# Altium schematic sheet Sheet1.SchDoc
size A2
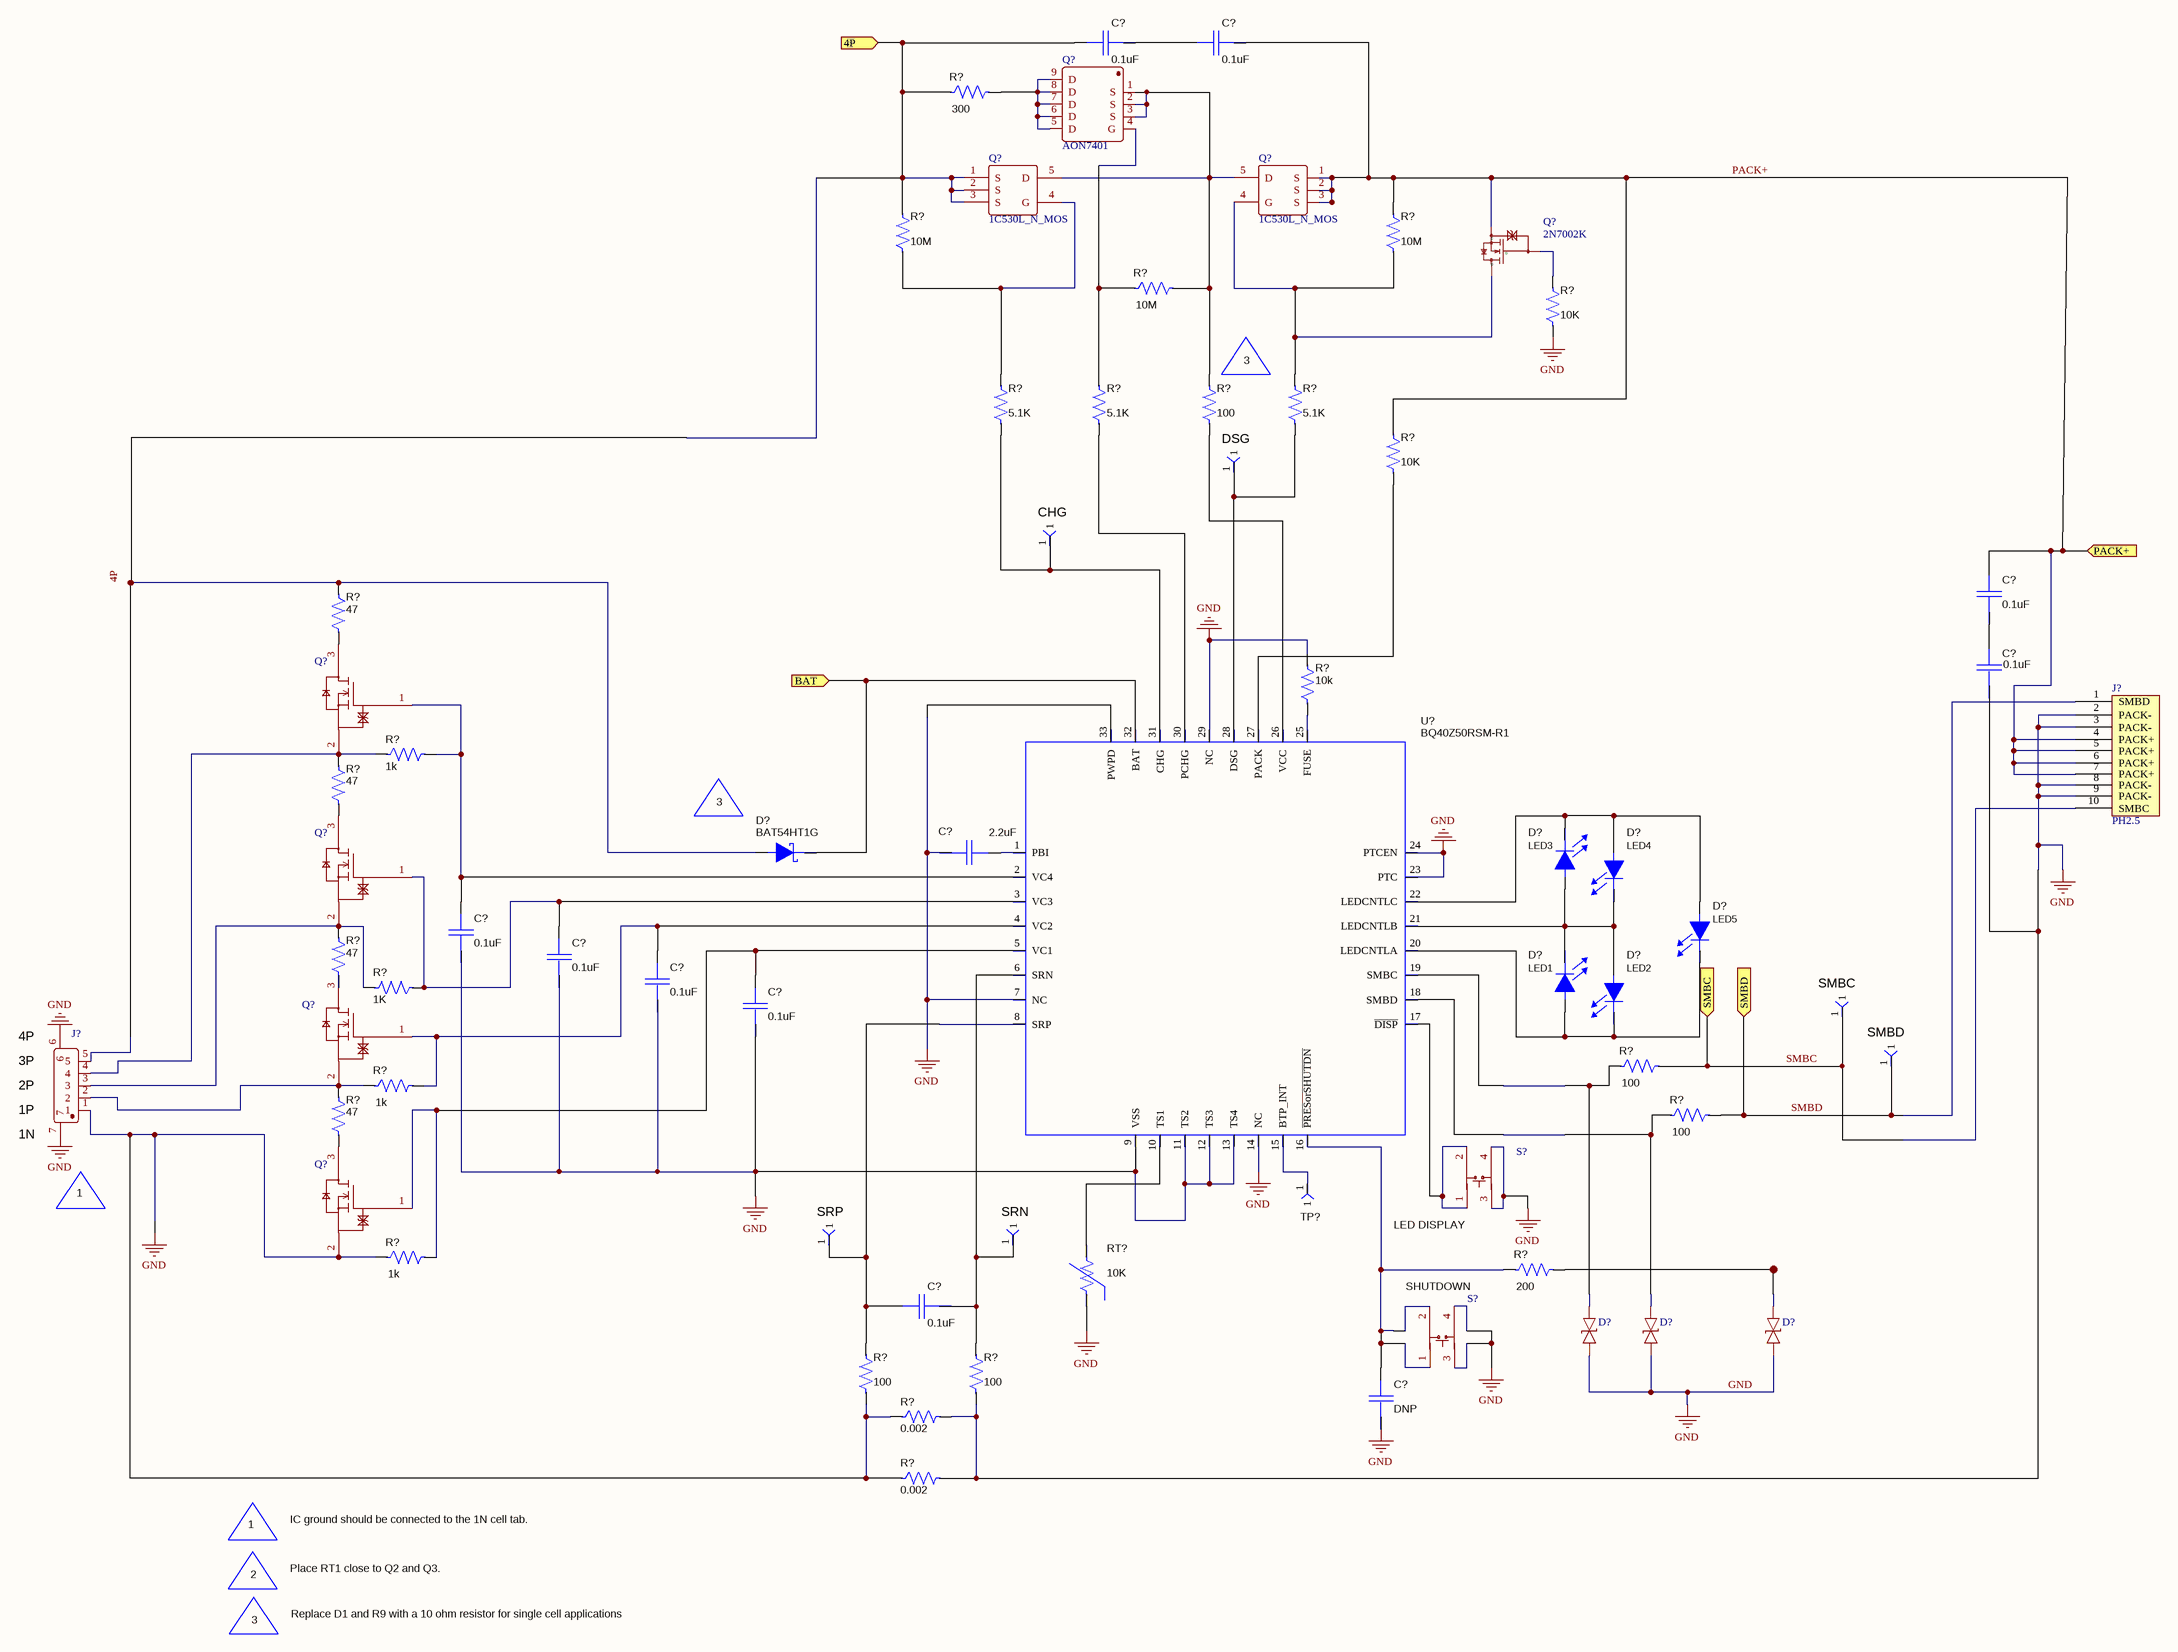
[diagram p0: Sheet1.SchDoc]

## Parts
(Parts that share a designator on the sheet are numbered #1, #2 ... from top to bottom, then left to right.)
C?#1  value 0.1uF  [C603]  (hidden comment: C0603C104M5RACTU)
C?#2  value 0.1uF  [C603]  (hidden comment: C0603C104M5RACTU)
C?#3  value 0.1uF  [C603]  (hidden comment: C0603C104M5RACTU)
C?#4  value 0.1uF  [C603]  (hidden comment: C0603C104M5RACTU)
C?#5  value 2.2uF  [C0805]  (hidden comment: C2012X7R1E225M085AB)
C?#6  value 0.1uF  [C603]  (hidden comment: C0603C104M5RACTU)
C?#7  value 0.1uF  [C603]  (hidden comment: C0603C104M5RACTU)
C?#8  value 0.1uF  [C603]  (hidden comment: C0603C104M5RACTU)
C?#9  value 0.1uF  [C603]  (hidden comment: C0603C104M5RACTU)
C?#10  value 0.1uF  [C603]  (hidden comment: C0603C104M5RACTU)
C?#11  value DNP  [C603]  (hidden comment: C0603C104M5RACTU)
D?#1  D_LED_SML-LXR1206USBC-TR  [LED0805]  (value not drawn)
D?#2  value BAT54HT1G  [SOD-323]  (hidden comment: D-BAT54HT1)
D?#3  D_LED_SML-LXR1206USBC-TR  [LED0805]  (value not drawn)
D?#4  D_LED_SML-LXR1206USBC-TR  [LED0805]  (value not drawn)
D?#5  D_LED_SML-LXR1206USBC-TR  [LED0805]  (value not drawn)
D?#6  D_LED_SML-LXR1206USBC-TR  [LED0805]  (value not drawn)
D?#7  ESD_Diode  [ESD_Diode]  (value not drawn)
D?#8  ESD_Diode  [ESD_Diode]  (value not drawn)
D?#9  ESD_Diode  [ESD_Diode]  (value not drawn)
J?#1  PH2.5  [PH2.5]
J?#2  SMD_1.25  [SMD_1.25]  (value not drawn)
Q?#1  AON7401  [DFN-8]
Q?#2  1C530L_N_MOS  [LFPAK]
Q?#3  1C530L_N_MOS  [LFPAK]
Q?#4  2N7002K  [2N7002K]
Q?#5  DMN601K  [SOT-23 - duplicate]  (value not drawn)
Q?#6  DMN601K  [SOT-23 - duplicate]  (value not drawn)
Q?#7  DMN601K  [SOT-23 - duplicate]  (value not drawn)
Q?#8  DMN601K  [SOT-23 - duplicate]  (value not drawn)
R?#1  value 300  [R2512]  (hidden comment: CRCW2512300RJNEG)
R?#2  value 10M  [0603]  (hidden comment: CRCW060310M0JNEA)
R?#3  value 10M  [0603]  (hidden comment: CRCW060310M0JNEA)
R?#4  value 10M  [0603]  (hidden comment: CRCW060310M0JNEA)
R?#5  value 10K  [0603]  (hidden comment: CRCW060310M0JNEA)
R?#6  value 5.1K  [0603]  (hidden comment: CRCW06035K10JNEA)
R?#7  value 5.1K  [0603]  (hidden comment: CRCW06035K10JNEA)
R?#8  value 100  [0603]  (hidden comment: CRCW0603100RJNEAHP)
R?#9  value 5.1K  [0603]  (hidden comment: CRCW06035K10JNEA)
R?#10  value 10K  [0603]  (hidden comment: CRCW060310K0JNEA)
R?#11  value 47  [R1206]  (hidden comment: CSR1206-0R001F1)
R?#12  value 10k  [0603]  (hidden comment: CRCW06035K10JNEA)
R?#13  value 47  [R1206]  (hidden comment: CSR1206-0R001F1)
R?#14  value 1k  [0603]  (hidden comment: CRCW0603100RJNEAHP)
R?#15  value 47  [R1206]  (hidden comment: CSR1206-0R001F1)
R?#16  value 1K  [0603]  (hidden comment: CRCW0603100RJNEAHP)
R?#17  value 100  [0603]  (hidden comment: CRCW0603100RJNEAHP)
R?#18  value 1k  [0603]  (hidden comment: CRCW0603100RJNEAHP)
R?#19  value 100  [0603]  (hidden comment: CRCW0603100RJNEAHP)
R?#20  value 47  [R1206]  (hidden comment: CSR1206-0R001F1)
R?#21  value 1k  [0603]  (hidden comment: CRCW0603100RJNEAHP)
R?#22  value 200  [0603]  (hidden comment: CRCW0603200RJNEA)
R?#23  value 100  [0603]  (hidden comment: CRCW0603100RJNEAHP)
R?#24  value 100  [0603]  (hidden comment: CRCW0603100RJNEAHP)
R?#25  value 0.002  [R2512]  (hidden comment: CRCW2512300RJNEG)
R?#26  value 0.002  [R2512]  (hidden comment: CRCW2512300RJNEG)
RT?  value 10K  [C0805]  (hidden comment: 103AT-2)
S?#1  SW_SMD  [SW_SMD]  (value not drawn)
S?#2  SW_SMD  [SW_SMD]  (value not drawn)
TP?#1  TP_.040_SMT  [TP_.040_SMT]  (value not drawn)  (no BOM)
TP?#2  TP_.040_SMT  [TP_.040_SMT]  (value not drawn)  (no BOM)
TP?#3  TP_.040_SMT  [TP_.040_SMT]  (value not drawn)  (no BOM)
TP?#4  TP_.040_SMT  [TP_.040_SMT]  (value not drawn)  (no BOM)
TP?#5  TP_40_SMT  [TP_40_SMT]  (value not drawn)  (no BOM)
TP?#6  TP_40_SMT  [TP_40_SMT]  (value not drawn)  (no BOM)
TP?#7  TP_.040_SMT  [TP_.040_SMT]  (value not drawn)  (no BOM)
U?  value BQ40Z50RSM-R1  [QFP-32P_(RSM)]  (hidden comment: BQ40Z55RSM)

## Ports
4P, BAT, PACK+, SMBC, SMBD

## Nets
GND: C?#4.1 C?#5.1 C?#6.1 C?#7.1 C?#8.1 C?#9.1 C?#11.1 D?#7.1 D?#8.1 D?#9.1 J?#1.2(PACK-) J?#1.3(PACK-) J?#1.8(PACK-) J?#1.9(PACK-) J?#2.1 J?#2.6 J?#2.7 Q?#8.2(S) R?#5.1 R?#12.2 R?#21.1 R?#23.1 R?#24.1 R?#25.1 R?#25.2 R?#26.1 R?#26.2 RT?.1 S?#1.3 S?#1.4 S?#2.3 S?#2.4 U?.7(NC) U?.9(VSS) U?.11(TS2) U?.12(TS3) U?.13(TS4) U?.14(NC) U?.23(PTC) U?.24(PTCEN) U?.29(NC) U?.33(PWPD)
4P: C?#1.2 D?#2.2(A) J?#2.5 Q?#2.1(S) Q?#2.2(S) Q?#2.3(S) R?#1.1 R?#2.2 R?#11.1 ; port 4P
BAT: D?#2.1(C) U?.32(BAT) ; port BAT
PACK+: C?#2.1 C?#3.2 J?#1.4(PACK+) J?#1.5(PACK+) J?#1.6(PACK+) J?#1.7(PACK+) Q?#3.1(S) Q?#3.2(S) Q?#3.3(S) Q?#4.2(S) R?#3.2 R?#10.2 ; port PACK+
SMBC: J?#1.10(SMBC) R?#17.2 TP?#3.1 ; port SMBC
SMBD: J?#1.1(SMBD) R?#19.2 TP?#4.1 ; port SMBD
NetC?#1_1: C?#1.1 C?#2.2
NetC?#3_1: C?#3.1 C?#4.2
NetC?#5_2: C?#5.2 U?.1(PBI)
NetC?#6_2: C?#6.2 Q?#5.1(G) R?#14.2 U?.2(VC4)
NetC?#7_2: C?#7.2 Q?#6.1(G) R?#16.1 U?.3(VC3)
NetC?#8_2: C?#8.2 Q?#7.1(G) R?#18.2 U?.4(VC2)
NetC?#9_2: C?#9.2 Q?#8.1(G) R?#21.2 U?.5(VC1)
NetC?#10_1: C?#10.1 R?#24.2 TP?#7.1 U?.6(SRN)
NetC?#10_2: C?#10.2 R?#23.2 TP?#6.1 U?.8(SRP)
NetC?#11_2: C?#11.2 R?#22.1 S?#2.1 S?#2.2 U?.16(~{PRESorSHUTDN})
NetD?#1_1: D?#1.1(C) D?#3.2(A) D?#5.2(A) D?#6.1(C) U?.21(LEDCNTLB)
NetD?#1_2: D?#1.2(A) D?#3.1(C) D?#4.2(A) U?.22(LEDCNTLC)
NetD?#4_1: D?#4.1(C) D?#5.1(C) D?#6.2(A) U?.20(LEDCNTLA)
NetD?#7_2: D?#7.2 R?#17.1 U?.19(SMBC)
NetD?#8_2: D?#8.2 R?#19.1 U?.18(SMBD)
NetD?#9_2: D?#9.2 R?#22.2
NetJ?#2_2: J?#2.2 Q?#7.2(S) R?#18.1 R?#20.2
NetJ?#2_3: J?#2.3 Q?#6.2(S) R?#15.2 R?#16.2
NetJ?#2_4: J?#2.4 Q?#5.2(S) R?#13.1 R?#14.1
NetQ?#1_1: Q?#1.1(S) Q?#1.2(S) Q?#1.3(S) Q?#2.5(D) Q?#3.5(D) R?#4.2 R?#8.2
NetQ?#1_4: Q?#1.4(G) R?#4.1 R?#7.2
NetQ?#1_5: Q?#1.5(D) Q?#1.6(D) Q?#1.7(D) Q?#1.8(D) Q?#1.9(D) R?#1.2
NetQ?#2_4: Q?#2.4(G) R?#2.1 R?#6.2
NetQ?#3_4: Q?#3.4(G) Q?#4.3(D) R?#3.1 R?#9.2
NetQ?#4_1: Q?#4.1(G) R?#5.2
NetQ?#5_3: Q?#5.3(D) R?#11.2
NetQ?#6_3: Q?#6.3(D) R?#13.2
NetQ?#7_3: Q?#7.3(D) R?#15.1
NetQ?#8_3: Q?#8.3(D) R?#20.1
NetR?#6_1: R?#6.1 TP?#2.1 U?.31(CHG)
NetR?#7_1: R?#7.1 U?.30(PCHG)
NetR?#8_1: R?#8.1 U?.26(VCC)
NetR?#9_1: R?#9.1 TP?#1.1 U?.28(DSG)
NetR?#10_1: R?#10.1 U?.27(PACK)
NetR?#12_1: R?#12.1 U?.25(FUSE)
NetRT?_2: RT?.2 U?.10(TS1)
NetS?#1_1: S?#1.1 S?#1.2 U?.17(~{DISP})
NetTP?#5_1: TP?#5.1 U?.15(BTP_INT)

## Notes on the sheet
- (near R?#8) 3
- DSG
- (near TP?#2) CHG
- 3
- (near D?#3) LED3
- (near D?#1) LED4
- (near D?#4) LED5
- (near D?#6) LED1
- (near D?#5) LED2
- (near TP?#3) SMBC
- (near J?#2) 4P
- (near J?#2) 3P
- (near TP?#4) SMBD
- (near J?#2) 2P
- (near J?#2) 1P
- (near J?#2) 1N
- 1
- (near TP?#6) SRP
- (near TP?#7) SRN
- (near S?#1) LED DISPLAY
- (near S?#2) SHUTDOWN
- IC ground should be connected to the 1N cell tab.
- 2
- Place RT1 close to Q2 and Q3.
- Replace D1 and R9 with a 10 ohm resistor for single cell applications
- Labels drawn without touching a wire or pin: 4P

## Library data of the parts
C?#1-C?#4 C?#6-C?#11 = C0603: Capacitor, Ceramic Chip, 50V, X7R, ±20%; Manufacturer: Kemet; Area: 5650; ComponentHeight: 0.035 inch; SymbolVersion: 07/31/2009 12:17:27; PartNumber: C0603C104M5RACTU; PackageReference: 603; ComponentLink1Description: AEO Datasheet Link
C?#5 = C0805: Capacitor, Ceramic Chip, 25V, X7R ±20%; Manufacturer: TDK; Area: 10560; ComponentHeight: 0.053 inch; SymbolVersion: 06/23/2010 08:22:44; PartNumber: C2012X7R1E225M085AB; PackageReference: 805; ComponentLink1Description: AEO Datasheet Link
D?#1 D?#3-D?#6 = D_LED_SML-LXR1206USBC-TR: Diode, LED, 2X3mm 565nm GRN WTR CLR SMD; PartNumber: SML-LX23GC; Manufacturer: Lumex; Area: 22000; Value: SML-LX23GC; ComponentLink1URL: \\vette02\pmp_pcb\pcad_pdf's\SML-LXR1206USBC-TR[1].pdf; SymbolVersion: 08/01/2007 15:25:38; PackageReference: 1206; ComponentHeight: 0.041 inch; ComponentLink1Description: AEO Datasheet Link
D?#2 = D-BAT54HT1: Diode, Schottky, 200-mA, 30-V; Manufacturer: On Semi; Area: 14105; ComponentHeight: 0.043 inch; ComponentLink1URL: \\vette02\pmp_pcb\pcad_pdf's\BAT54HT1-D.pdf; SymbolVersion: 02/28/2007 14:26:03; PackageReference: SOD323; PartNumber: BAT54HT1G; ComponentLink1Description: AEO Datasheet Link
R?#1 R?#25 R?#26 = R2512_5%: Resistor, Chip 1W, 5%; Manufacturer: Vishay-Dale; Area: 56,000; SymbolVersion: 05/06/2011 14:04:06; PackageReference: 2512; PartNumber: CRCW2512300RJNEG; ComponentLink1Description: AEO Datasheet Link
R?#2-R?#10 R?#12 R?#14 R?#16-R?#19 R?#21 R?#23 R?#24 = R0603_1%: Resistor, Chip, 1/10W, 5%; Manufacturer: Vishay-Dale; Area: 9100; SymbolVersion: 05/06/2011 13:51:33; PackageReference: 603; ComponentLink1Description: AEO Datasheet Link
  R?#2-R?#5: PartNumber: CRCW060310M0JNEA
  R?#6 R?#7 R?#9 R?#12: PartNumber: CRCW06035K10JNEA
  R?#8 R?#14 R?#16-R?#19 R?#21 R?#23 R?#24: PartNumber: CRCW0603100RJNEAHP
  R?#10: PartNumber: CRCW060310K0JNEA
R?#11 R?#13 R?#15 R?#20 = R1206_1%: Resistor, Chip 1 watt, ±1%, 50 ppm; Manufacturer: Reidon; Area: 20,000; SymbolVersion: 05/06/2011 13:59:00; PackageReference: 1206; PartNumber: CSR1206-0R001F1; ComponentLink1Description: AEO Datasheet Link
R?#22 = R0603_1%: Resistor, Chip, 1/16W, 5%; Manufacturer: Vishay-Dale; Area: 9100; SymbolVersion: 05/06/2011 13:51:33; PackageReference: 603; PartNumber: CRCW0603200RJNEA; ComponentLink1Description: AEO Datasheet Link
RT? = THERMISTOR-103AT: Thermistor, NTC, 3-A; Manufacturer: Semitec; Area: 25,000; ComponentHeight: 0.335 inch; ComponentLink1URL: \\vette02\pmp_pcb\pcad_pdf's\AT_Thermistor.pdf; PackageReference: 0.095 X 0.150 inch; SymbolVersion: 07/31/2009 12:17:31; PartNumber: 103AT-2; ComponentLink1Description: AEO Datasheet Link
TP?#1-TP?#4 TP?#7 = TP_.040_SMT: Test point, 40 mil SMT; Value: None; ComponentHeight: None; area: *; SymbolVersion: 11/01/2006 14:05:31; PackageReference: None; Manufacturer: None; PartNumber: None; ComponentLink1Description: AEO Datasheet Link
TP?#5 TP?#6 = TP_40_SMT: Test point, 40 mil SMT; Manufacturer: None; Value: None; ComponentHeight: None; SymbolVersion: 07/13/2010 09:50:06; area: *; PackageReference: None; PartNumber: None; ComponentLink1Description: AEO Datasheet Link
U? = BQ40Z55RSM: IC, 2 to 4-Series Li-Ion Battery Pack Manager; Manufacturer: TI; Alternate Manufacturer: None; Area: 51072; ComponentHeight: 0.04mil; ComponentLink1URL: \\vette02\pmp_pcb\pcad_pdf's\bq40z55_DS.pdf; SymbolVersion: 06/22/2012 10:16:53; PackageReference: QFN; PartNumber: BQ40Z50RSM-R1; ComponentLink1Description: AEO Datasheet Link